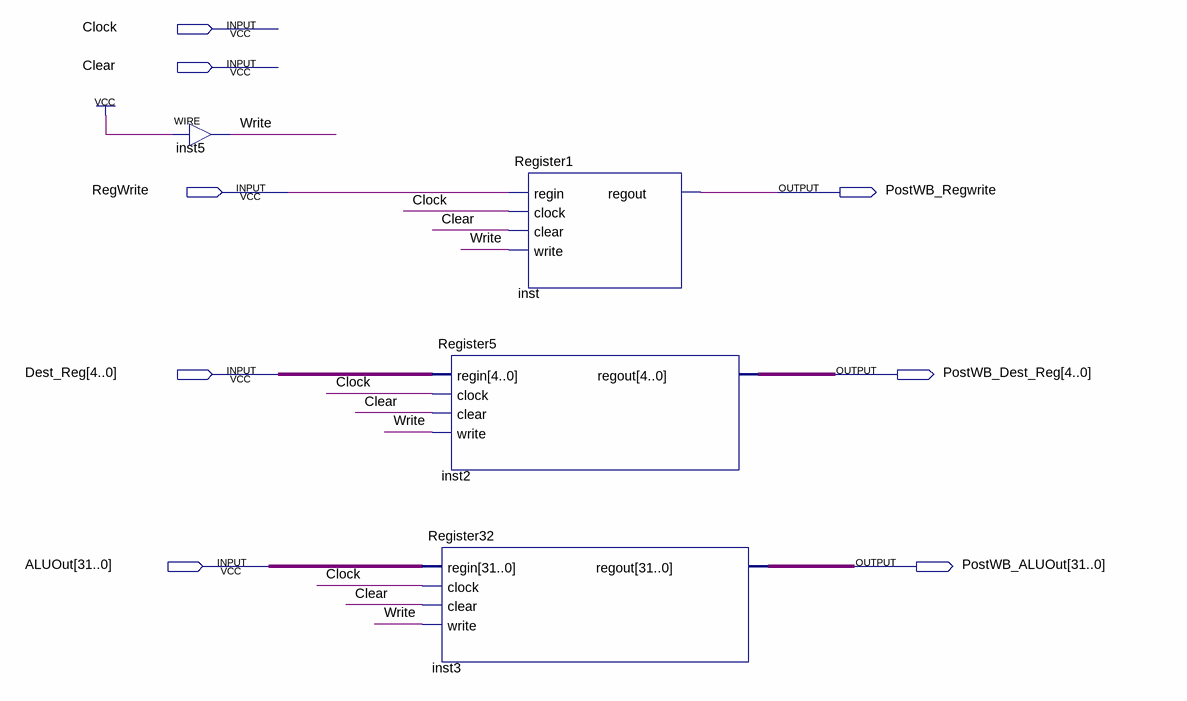
[diagram p0: schematic sheet]
// Quartus schematic PostWBRegs.bdf as structural Verilog: 4 symbols, 8 pins
module PostWBRegs (
  input  Clock,
  input  Clear,
  input  RegWrite,
  input  [4:0] Dest_Reg,
  input  [31:0] ALUOut,
  output PostWB_Regwrite,
  output [4:0] PostWB_Dest_Reg,
  output [31:0] PostWB_ALUOut
);

  wire Write;

  assign Write = 1'b1;  // WIRE inst5
  Register5 inst2 (.regin(Dest_Reg), .clock(Clock), .clear(Clear), .write(Write), .regout(PostWB_Dest_Reg));
  Register32 inst3 (.regin(ALUOut), .clock(Clock), .clear(Clear), .write(Write), .regout(PostWB_ALUOut));
  Register1 inst (.regin(RegWrite), .clock(Clock), .clear(Clear), .write(Write), .regout(PostWB_Regwrite));
endmodule
